# Altium project ATomExtension.PrjPcb
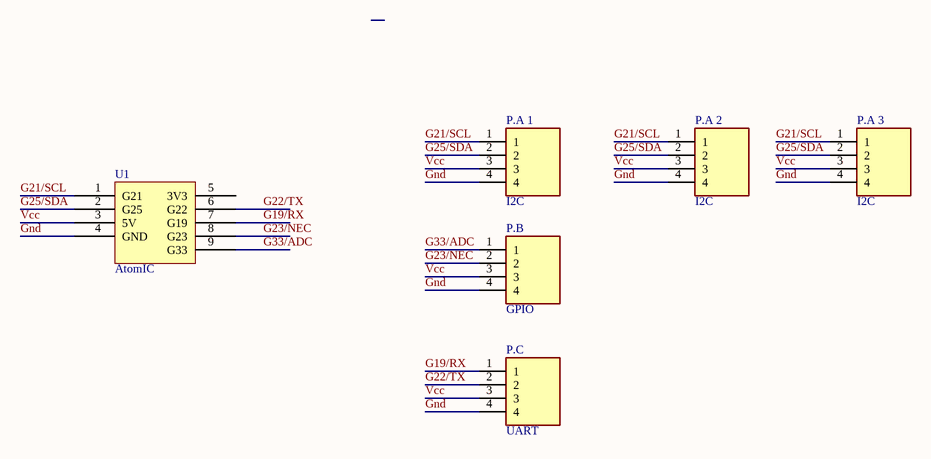
[diagram p0: SCH_ATOMExtension.SchDoc]
1 sheet, 6 parts. Net scope: global (net labels, ports and power ports of the same name join across sheets).
Board file: PCB_AtomExtension.PcbDoc

## Sheet SCH_ATOMExtension.SchDoc
size A; SheetNumber: 1; SheetTotal: 1

### Parts
P.A_1  I2C  [SEEED_110990030]
P.A_2  I2C  [SEEED_110990030]
P.A_3  I2C  [SEEED_110990030]
P.B  GPIO  [SEEED_110990030]
P.C  UART  [SEEED_110990030]
U1  AtomIC  [SPGA48x11]

### Nets
G19/RX: P.C.1 U1.7(G19)
G21/SCL: P.A_1.1 P.A_2.1 P.A_3.1 U1.1(G21)
G22/TX: P.C.2 U1.6(G22)
G23/NEC: P.B.2 U1.8(G23)
G25/SDA: P.A_1.2 P.A_2.2 P.A_3.2 U1.2(G25)
G33/ADC: P.B.1 U1.9(G33)
Gnd: P.A_1.4 P.A_2.4 P.A_3.4 P.B.4 P.C.4 U1.4(GND)
Vcc: P.A_1.3 P.A_2.3 P.A_3.3 P.B.3 P.C.3 U1.3(5V)

Not connected (* = marked no-connect by the designer): U1 5(3V3)

### Library data of the parts
P.A_1-P.A_3 P.B P.C = 110990030: GROVE 2MM 4PIN VERT CONN 10PCS; MF: Seeed Technology; Arrow_Electronics-Purchase-URL: https://snapeda.com/shop?store=Arrow+Electronics&id=583576; Availability: Good; Package: None; Price: None; Mouser-Purchase-URL: https://snapeda.com/shop?store=Mouser&id=583576; MP: 110990030; SnapEDA_Link: https://www.snapeda.com/parts/110990030/Seeed%20Technology%20Co.,%20Ltd/view-part/583576/?ref=snap; Value: *